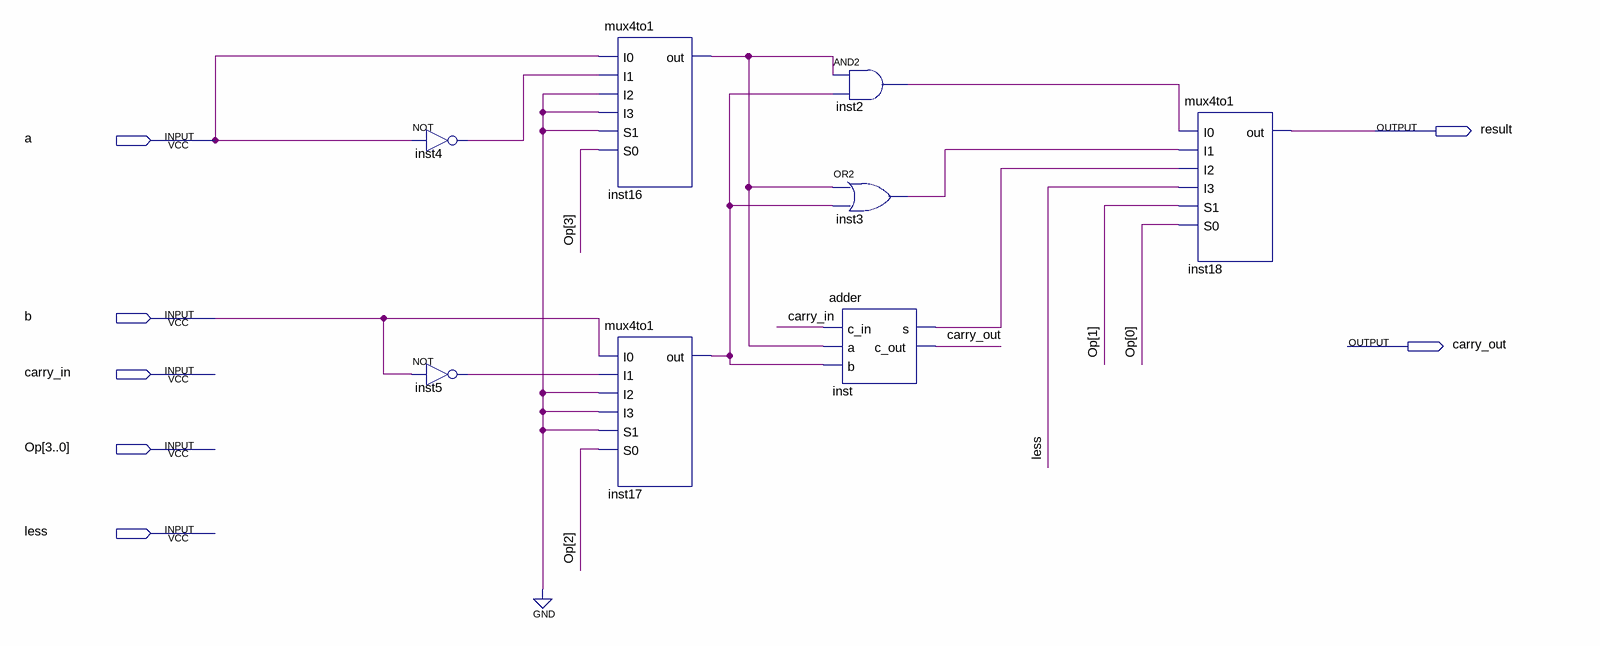
[diagram p0: schematic sheet]
// Quartus schematic ordinary.bdf as structural Verilog: 8 symbols, 7 pins
module ordinary (
  input  a,
  input  b,
  input  carry_in,
  input  [3:0] Op,
  input  less,
  output result,
  output carry_out
);

  wire inst2_out, inst3_out, inst4_out, inst5_out, inst16_out, inst17_out, inst_s;

  not inst4 (inst4_out, a);
  not inst5 (inst5_out, b);
  mux4to1 inst16 (.I0(a), .I1(inst4_out), .I2(1'b0), .I3(1'b0), .S1(1'b0), .S0(Op[3]), .out(inst16_out));
  mux4to1 inst17 (.I0(b), .I1(inst5_out), .I2(1'b0), .I3(1'b0), .S1(1'b0), .S0(Op[2]), .out(inst17_out));
  and inst2 (inst2_out, inst16_out, inst17_out);
  or inst3 (inst3_out, inst16_out, inst17_out);
  adder inst (.c_in(carry_in), .a(inst16_out), .b(inst17_out), .s(inst_s), .c_out(carry_out));
  mux4to1 inst18 (.I0(inst2_out), .I1(inst3_out), .I2(inst_s), .I3(less), .S1(Op[1]), .S0(Op[0]), .out(result));
endmodule
